# EAGLE design receiver (EAGLE 5.09)
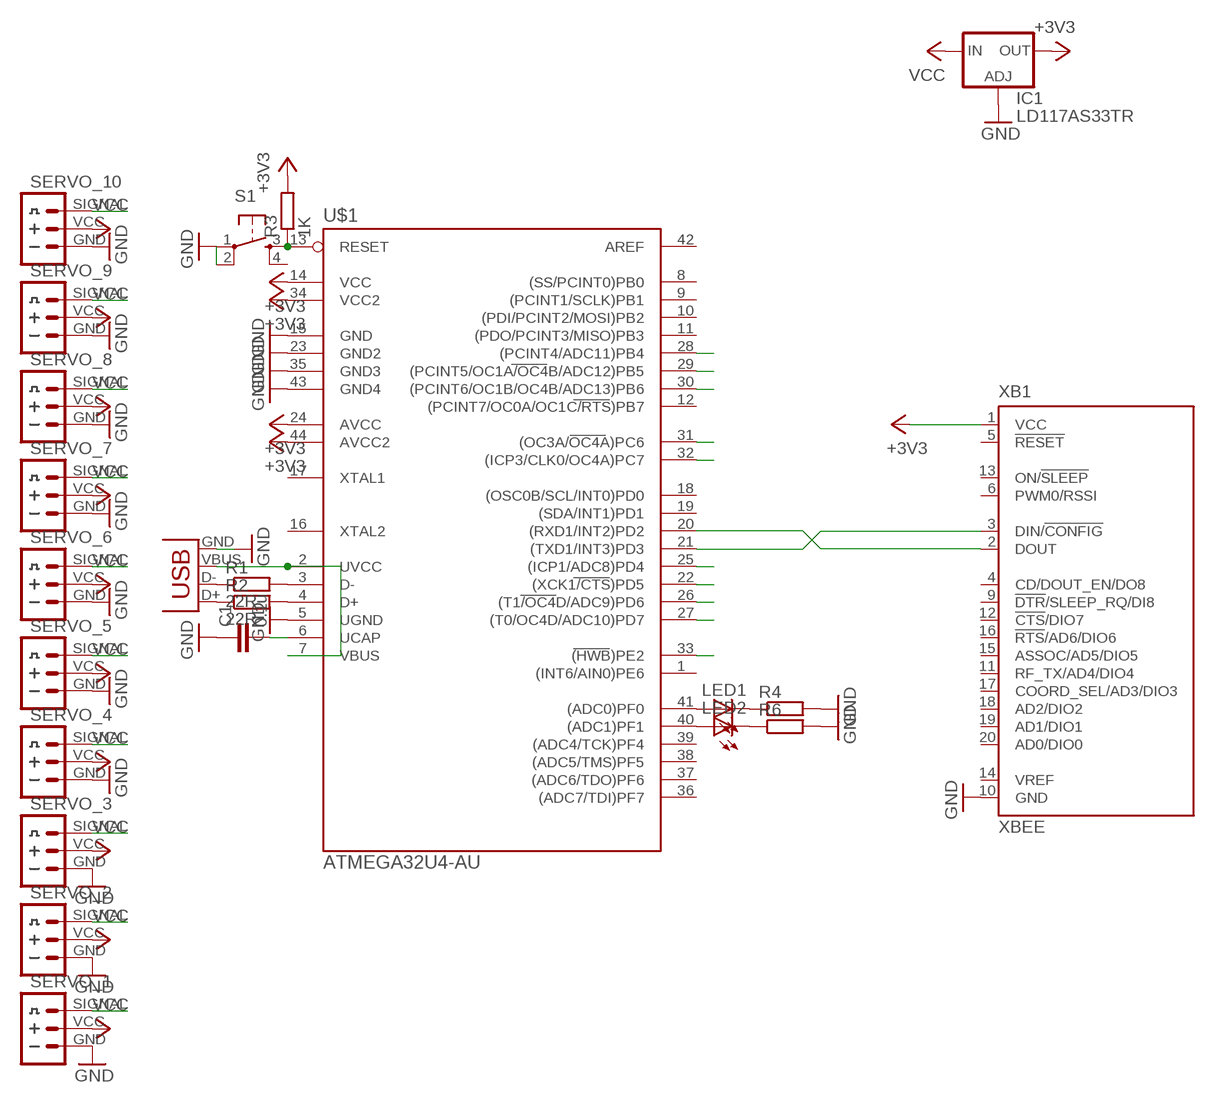
[diagram p0: schematic, sheet 1]

## Parts
C1  0.1u  C-EUC1206  [C1206]
IC1  LD117AS33TR  [SOT223]
LED1  LEDCHIPLED_1206  [CHIPLED_1206]
LED2  LEDCHIPLED_1206  [CHIPLED_1206]
R1  22R  R-EU_R1206  [R1206]
R2  22R  R-EU_R1206  [R1206]
R3  1K  R-EU_R1206  [R1206]
R4  R-EU_R1206  [R1206]
R6  R-EU_R1206  [R1206]
S1  TAC_SWITCHSMD  [TACTILE_SWITCH_SMD]
SERVO_1  SERVO  [SERVO]
SERVO_2  SERVO  [SERVO]
SERVO_3  SERVO  [SERVO]
SERVO_4  SERVO  [SERVO]
SERVO_5  SERVO  [SERVO]
SERVO_6  SERVO  [SERVO]
SERVO_7  SERVO  [SERVO]
SERVO_8  SERVO  [SERVO]
SERVO_9  SERVO  [SERVO]
SERVO_10  SERVO  [SERVO]
U$1  ATMEGA32U4-AU  [TQFP44]
X1  USBSMD  [USB-MINIB]
XB1  XBEE  [XBEE]

## Nets
+3V3: IC1.4(OUT) R3.2 U$1.14(VCC) U$1.24(AVCC) U$1.34(VCC2) U$1.44(AVCC2) XB1.1(VCC)
GND: C1.1 IC1.1(ADJ) R4.2 R6.2 S1.1 S1.2 SERVO_1.GND SERVO_2.GND SERVO_3.GND SERVO_4.GND SERVO_5.GND SERVO_6.GND SERVO_7.GND SERVO_8.GND SERVO_9.GND SERVO_10.GND U$1.5(UGND) U$1.15(GND) U$1.23(GND2) U$1.35(GND3) U$1.43(GND4) X1.GND XB1.10(GND)
N$1: R3.1 S1.3 U$1.13(RESET)
N$2: R1.1 X1.D-
N$3: R1.2 U$1.3(D-)
N$4: U$1.2(UVCC) U$1.7(VBUS) X1.VBUS
N$5: C1.2 U$1.6(UCAP)
N$6: R2.1 X1.D+
N$7: R2.2 U$1.4(D+)
N$8: U$1.21((TXD1/INT3)PD3) XB1.3(DIN/!CONFIG)
N$9: U$1.20((RXD1/INT2)PD2) XB1.2(DOUT)
N$10: LED1.A U$1.41((ADC0)PF0)
N$11: LED2.A U$1.40((ADC1)PF1)
N$12: LED1.C R4.1
N$14: LED2.C R6.1
SV1: SERVO_1.SIGNAL U$1.33((HWB)PE2)
SV2: SERVO_2.SIGNAL U$1.32((ICP3/CLK0/OC4A)PC7)
SV3: SERVO_3.SIGNAL U$1.31((OC3A/OC4A)PC6)
SV4: SERVO_4.SIGNAL U$1.30((PCINT6/OC1B/OC4B/ADC13)PB6)
SV5: SERVO_5.SIGNAL U$1.29((PCINT5/OC1A/OC4B/ADC12)PB5)
SV6: SERVO_6.SIGNAL U$1.28((PCINT4/ADC11)PB4)
SV7: SERVO_7.SIGNAL U$1.27((T0/OC4D/ADC10)PD7)
SV8: SERVO_8.SIGNAL U$1.26((T1/OC4D/ADC9)PD6)
SV9: SERVO_9.SIGNAL U$1.25((ICP1/ADC8)PD4)
SV10: SERVO_10.SIGNAL U$1.22((XCK1/CTS)PD5)
VCC: IC1.3(IN) SERVO_1.VCC SERVO_2.VCC SERVO_3.VCC SERVO_4.VCC SERVO_5.VCC SERVO_6.VCC SERVO_7.VCC SERVO_8.VCC SERVO_9.VCC SERVO_10.VCC
Unconnected: S1.4 U$1.1((INT6/AIN0)PE6) U$1.8((SS/PCINT0)PB0) U$1.9((PCINT1/SCLK)PB1) U$1.10((PDI/PCINT2/MOSI)PB2) U$1.11((PDO/PCINT3/MISO)PB3) U$1.12((PCINT7/OC0A/OC1C/RTS)PB7) U$1.16(XTAL2) U$1.17(XTAL1) U$1.18((OSC0B/SCL/INT0)PD0) U$1.19((SDA/INT1)PD1) U$1.36((ADC7/TDI)PF7) U$1.37((ADC6/TDO)PF6) U$1.38((ADC5/TMS)PF5) U$1.39((ADC4/TCK)PF4) U$1.42(AREF) XB1.4(CD/DOUT_EN/DO8) XB1.5(!RESET) XB1.6(PWM0/RSSI) XB1.9(!DTR!/SLEEP_RQ/DI8) XB1.11(RF_TX/AD4/DIO4) XB1.12(!CTS!/DIO7) XB1.13(ON/!SLEEP) XB1.14(VREF) XB1.15(ASSOC/AD5/DIO5) XB1.16(!RTS!/AD6/DIO6) XB1.17(COORD_SEL/AD3/DIO3) XB1.18(AD2/DIO2) XB1.19(AD1/DIO1) XB1.20(AD0/DIO0)

## Library data of the parts
C1 = rcl:C-EU: CAPACITOR, European symbol
IC1 = v-reg:LD117A?*: Low drop fixed and adjustable positive voltage regulators 1 A Source: http://www.st.com/stonline/products/literature/ds/7194/ld1117axx.pdf
LED1 LED2 = led:LED: LED OSRAM: - CHIPLED LG R971, LG N971, LY N971, LG Q971, LY Q971, LO R971, LY R971 LH N974, LH R974 LS Q976, LO Q976, LY Q976 LO Q996 - Hyper CHIPLED LW Q18S LB Q993, LB Q99A, LB R99A - SideLED LS A670, LO A670, LY A670, LG A670, LP A670 LB A673, LV A673, LT A673, LW A673 LH A674 LY A675 LS A676, LA A676, LO A676, LY A676, LW A676 LS A679, LY A679, LG A679 - Hyper Micro SIDELED® LS Y876, LA Y876, LO Y876, LY Y876 LT Y87S - SmartLED LW L88C, LW L88S LB L89C, LB L89S, LG L890 LS L89K, LO L89K, LY L89K LS L896, LA L896, LO L896, LY L896 - TOPLED LS T670, LO T670, LY T670, LG T670, LP T670 LSG T670, LSP T670, LSY T670, LOP T670, LYG T670 LG T671, LOG T671, LSG T671 LB T673, LV T673, LT T673, LW T673 LH T674 LS T676, LA T676, LO T676, LY T676, LB T676, LH T676, LSB T676, LW T676 LB T67C, LV T67C, LT T67C, LS T67K, LO T67K, LY T67K, LW E67C LS E67B, LA E67B, LO E67B, LY E67B, LB E67C, LV E67C, LT E67C LW T67C LS T679, LY T679, LG T679 LS T770, LO T770, LY T770, LG T770, LP T770 LB T773, LV T773, LT T773, LW T773 LH T774 LS E675, LA E675, LY E675, LS T675 LS T776, LA T776, LO T776, LY T776, LB T776 LHGB T686 LT T68C, LB T68C - Hyper Mini TOPLED® LB M676 - Mini TOPLED Santana® LG M470 LS M47K, LO M47K, LY M47K Source: http://www.osram.convergy.de LUXEON: - LUMILED® LXK2-PW12-R00, LXK2-PW12-S00, LXK2-PW14-U00, LXK2-PW14-V00 LXK2-PM12-R00, LXK2-PM12-S00, LXK2-PM14-U00 LXK2-PE12-Q00, LXK2-PE12-R00, LXK2-PE12-S00, LXK2-PE14-T00, LXK2-PE14-U00 LXK2-PB12-K00, LXK2-PB12-L00, LXK2-PB12-M00, LXK2-PB14-N00, LXK2-PB14-P00, LXK2-PB14-Q00 LXK2-PR12-L00, LXK2-PR12-M00, LXK2-PR14-Q00, LXK2-PR14-R00 LXK2-PD12-Q00, LXK2-PD12-R00, LXK2-PD12-S00 LXK2-PH12-R00, LXK2-PH12-S00 LXK2-PL12-P00, LXK2-PL12-Q00, LXK2-PL12-R00 Source: www.luxeon.com KINGBRIGHT: KA-3528ASYC Source: www.kingbright.com
R1 R2 = rcl:R-EU_: RESISTOR, European symbol
R3 R4 R6 = resistor:R-EU_: RESISTOR, European symbol
S1 = SparkFun:TAC_SWITCH: Momentary Switch Button commonly used for reset or general input. Spark Fun Electronics SKU : COM-00097
SERVO_1-SERVO_10 = parag0n:SERVO: SERVO CONNECTOR Standard pinout servo connector
U$1 = mega32U4:ATMEGA32U4-AU
X1 = SparkFun:USB: USB Connectors USB-B-PTH is fully proven SKU : PRT-00139 USB-miniB is fully proven SKU : PRT-00587 USB-A-PCB is untested. USB-A-H is throughly reviewed, but untested. Spark Fun Electronics SKU : PRT-00437 USB-B-SMT is throughly reviewed, but untested. Needs silkscreen touching up. USB-A-S has not been used/tested USB-MB-H has not been used/tested
XB1 = maxstream:XBEE: XBee (TM) /XBee-PRO(TM) OEM RF Modules Source: MaxStream, Inc. xbee_productmanual.pdf

## Board
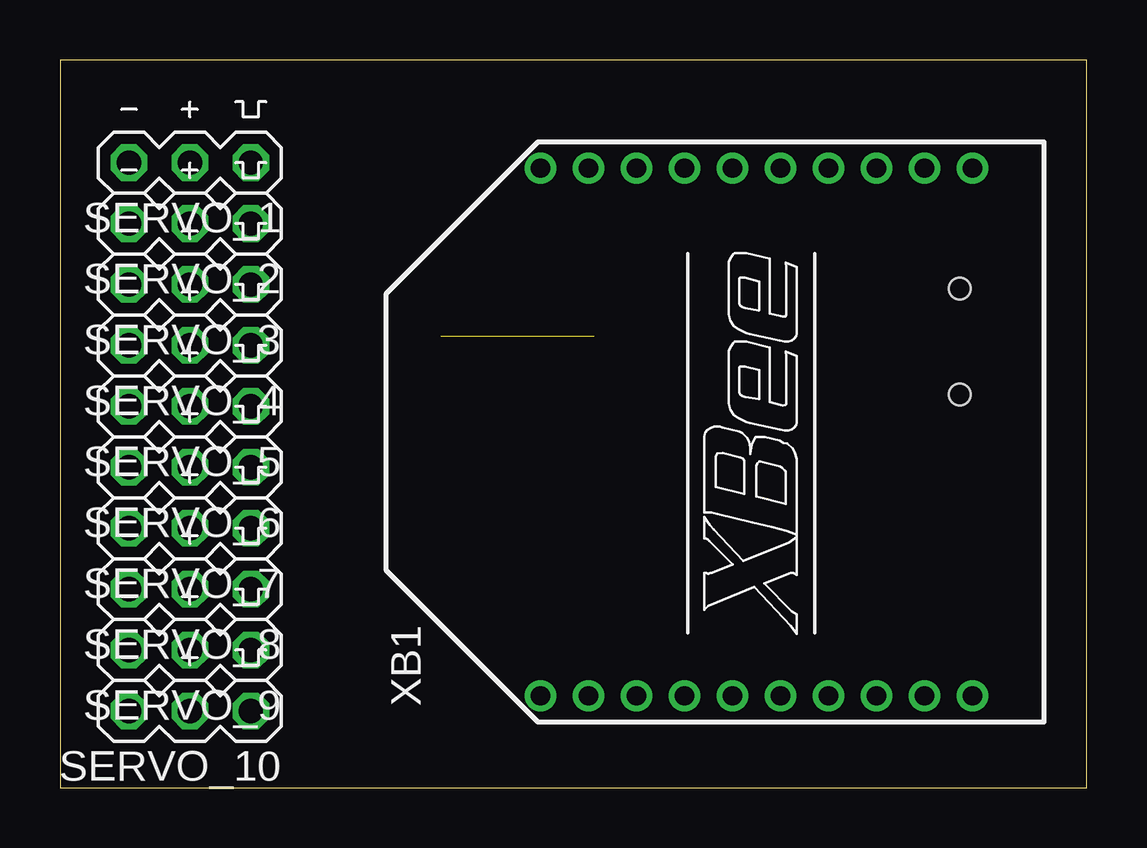
[diagram p1: board, top side]
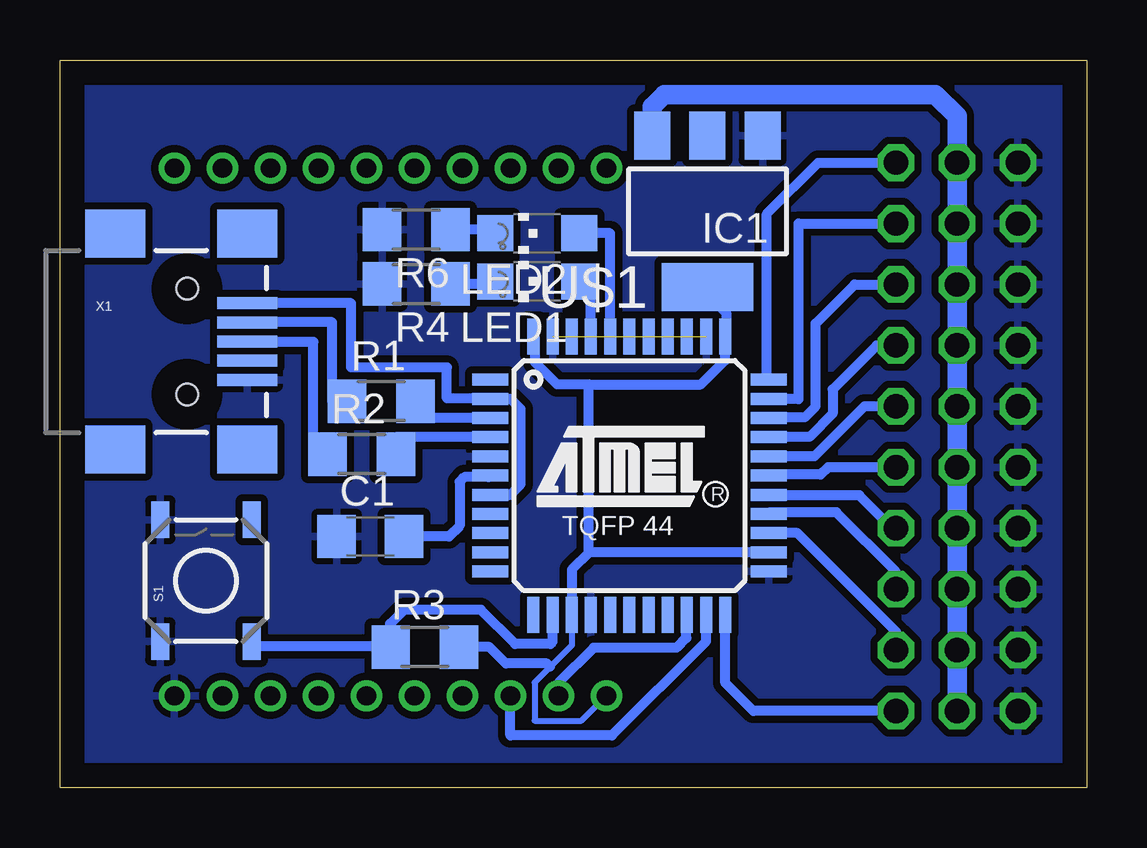
[diagram p2: board, bottom side, seen from below]

Size 42.79 x 30.34 mm. Coordinates in mm from the lower left corner, seen from the top.
Outline: 0,0 42.79,0 42.79,30.34 0,30.34 0,0
Copper layers (1*16): Top 0.035mm / dielectric 1.5mm / Bottom 0.035mm
Design rules "default": minimum track width 10mil, minimum drill 24mil, track to track 8mil, track to pad 8mil, pad to pad 8mil, via to via 8mil, smd to smd 8mil, copper to edge 40mil, drill to drill 8mil, minimum pad ring 10mil, minimum via ring 8mil, stop-mask expansion 4mil, vias tented up to drill 0mil, thermal gap 10mil

### Footprints (pad centres in the part's own frame; a part is rotated, then mirrored left to right if it is on the bottom)
C1206 = smd 1.6 x 1.8: 1 -1.4,0; 2 1.4,0
SOT223 = smd 1.5 x 2: 1 -2.3,-3.15; 2 0,-3.15; 3 2.3,-3.15 | smd 3.8 x 2: 4 0,3.15
CHIPLED_1206 = smd 1.5 x 1.5: A 0,-1.75; C 0,1.75
R1206 = smd 1.6 x 1.803: 1 -1.422,0; 2 1.422,0
TACTILE_SWITCH_SMD = smd 1.524 x 0.762: 1 -2.54,1.905; 2 2.54,1.905; 3 -2.54,-1.905; 4 2.54,-1.905
SERVO = drill 1.016 octagon: GND 2.54,0; SIGNAL -2.54,0; VCC 0,0
TQFP44 = smd 1.5 x 0.5: 1 -5.8,4; 2 -5.8,3.2; 3 -5.8,2.4; 4 -5.8,1.6; 5 -5.8,0.8; 6 -5.8,0; 7 -5.8,-0.8; 8 -5.8,-1.6; 9 -5.8,-2.4; 10 -5.8,-3.2; 11 -5.8,-4; 23 5.8,-4; 24 5.8,-3.2; 25 5.8,-2.4; 26 5.8,-1.6; 27 5.8,-0.8; 28 5.8,0; 29 5.8,0.8; 30 5.8,1.6; 31 5.8,2.4; 32 5.8,3.2; 33 5.8,4 | smd 0.5 x 1.5: 12 -4,-5.8; 13 -3.2,-5.8; 14 -2.4,-5.8; 15 -1.6,-5.8; 16 -0.8,-5.8; 17 0,-5.8; 18 0.8,-5.8; 19 1.6,-5.8; 20 2.4,-5.8; 21 3.2,-5.8; 22 4,-5.8; 34 4,5.8; 35 3.2,5.8; 36 2.4,5.8; 37 1.6,5.8; 38 0.8,5.8; 39 0,5.8; 40 -0.8,5.8; 41 -1.6,5.8; 42 -2.4,5.8; 43 -3.2,5.8; 44 -4,5.8
USB-MINIB = smd 2.5 x 0.5: D+ 2.5,0; D- 2.5,0.8; GND 2.5,-1.6; ID 2.5,-0.8; VBUS 2.5,1.6 | smd 2.5 x 2: GND@1 -3,-4.5; GND@2 -3,4.5; GND@3 2.5,4.5; GND@4 2.5,-4.5 | hole 0.9: 0,2.2; 0,-2.2
XBEE = drill 0.8 pad 1.27 round: 1 -11,9; 2 -11,7; 3 -11,5; 4 -11,3; 5 -11,1; 6 -11,-1; 7 -11,-3; 8 -11,-5; 9 -11,-7; 10 -11,-9; 11 11,-9; 12 11,-7; 13 11,-5; 14 11,-3; 15 11,-1; 16 11,1; 17 11,3; 18 11,5; 19 11,7; 20 11,9

### Placement (x,y rotation side)
C1  29.86,10.48 0 bottom
IC1  15.81,24.03 180 bottom
LED1  22.91,21.11 90 bottom
LED2  22.91,23.11 90 bottom
R1  29.4,16.12 0 bottom
R2  30.21,13.91 0 bottom
R3  27.58,5.87 0 bottom
R4  27.94,21.01 180 bottom
R6  27.94,23.27 180 bottom
S1  36.7,8.64 90 bottom
SERVO_1  5.41,26.06 180 top
SERVO_2  5.41,23.52 180 top
SERVO_3  5.41,20.98 180 top
SERVO_4  5.41,18.44 180 top
SERVO_5  5.41,15.9 180 top
SERVO_6  5.41,13.36 180 top
SERVO_7  5.41,10.82 180 top
SERVO_8  5.41,8.28 180 top
SERVO_9  5.41,5.74 180 top
SERVO_10  5.41,3.2 180 top
U$1  19.06,13.02 0 bottom
X1  37.49,18.61 0 bottom
XB1  29.02,14.83 90 top

### Tracks (layer width: path | path; a pad name or v marks a point on that pad's centre or on a via)
+3V3
  Bottom 0.254: U$1.14 21.46,5.94 22.36,5.04 23.01,4.39 23.01,2.79 21.06,2.79 XB1.1
  Bottom 0.406: U$1.44 22.99,18.74 22.99,17.73 22.07,16.82 20.75,16.82 | U$1.14 21.46,9.09 20.74,9.82 | 20.75,16.82 16.08,16.82 15.06,17.83 U$1.34 | U$1.34 | U$1.24 20.74,9.82 | 20.74,9.82 20.75,9.83 20.75,16.82 | IC1.4 15.81,20.56 15.01,19.76 15.01,18.87 U$1.34 | R3.2 24.89,5.87 24.21,5.18 22.5,5.18 22.36,5.04
GND  (1 unrouted)
  Bottom 0.406: U$1.15
  pour Bottom (isolate 0.305): -0.89,30.43 42.09,30.43 41.78,-0.86 -0.79,-0.56
N$1
  Bottom 0.406: U$1.13 22.26,6.08 22.35,5.99 23.83,5.99 25.25,7.42 28.45,7.42 29.03,6.83 29.03,5.89 | 29.03,5.89 R3.1 | 29.03,5.89 34.8,5.89 S1.3
N$2
  Bottom 0.406: R1.1 31.45,16.12 31.45,19.41 X1.D- | X1.D-
N$3
  Bottom 0.406: U$1.3 27.66,15.42 R1.2
N$4
  Bottom 0.406: U$1.7 24.03,12.22 23.6,12.65 23.6,15.8 24,16.21 24.31,16.21 | 24.31,16.21 24.85,16.21 U$1.2 | X1.VBUS 30.66,20.21 30.66,17.53 26.67,17.53 26.67,16.23 24.31,16.23 24.31,16.21
N$5
  Bottom 0.406: U$1.6 24.93,12.95 25.93,12.95 26.14,12.75 26.14,10.92 26.58,10.48 C1.2 28.41,10.48
N$6
  Bottom 0.406: R2.1 32.23,13.91 32.23,18.59 34.99,18.59 X1.D+
N$7
  Bottom 0.406: U$1.4 28.79,14.62 R2.2
N$8
  Bottom 0.406: U$1.21 15.86,6.11 19.79,2.18 24.02,2.18 XB1.3
N$9
  Bottom 0.406: XB1.2 22.02,4.37 20.55,5.84 17.09,5.84 16.69,6.25 16.69,7.19 U$1.20
N$10
  Bottom 0.406: U$1.41 20.66,21.11 LED1.A
N$11
  Bottom 0.406: U$1.40 19.86,23.11 LED2.A
N$12
  Bottom 0.406: LED1.C 24.66,21.01 R4.1
N$14
  Bottom 0.406: LED2.C 24.66,23.27 R6.1
SV1
  Bottom 0.406: SERVO_1.SIGNAL 11.2,26.06 13.34,23.93 13.34,17.09 U$1.33
SV2
  Bottom 0.406: SERVO_2.SIGNAL 12.01,23.52 12.01,16.21 13.28,16.21 U$1.32
SV3
  Bottom 0.406: SERVO_3.SIGNAL 9.68,20.98 11.3,19.36 11.3,15.9 11.76,15.44 13.24,15.44 U$1.31
SV4
  Bottom 0.406: SERVO_4.SIGNAL 8.76,18.44 10.59,16.61 10.59,15.6 11.56,14.63 U$1.30
SV5
  Bottom 0.406: SERVO_5.SIGNAL 9.27,15.9 11.35,13.82 U$1.29
SV6
  Bottom 0.406: SERVO_6.SIGNAL 10.8,13.36 11.1,13.06 13.22,13.06 U$1.28
SV7
  Bottom 0.406: SERVO_7.SIGNAL 8.1,10.82 9.47,12.19 13.24,12.19 U$1.27
SV8
  Bottom 0.406: SERVO_8.SIGNAL 7.95,8.99 10.44,11.48 13.2,11.48 U$1.26
SV9
  Bottom 0.406: SERVO_9.SIGNAL 7.95,6.5 12.07,10.62 U$1.25
SV10
  Bottom 0.406: SERVO_10.SIGNAL 13.89,3.2 15.06,4.37 U$1.22
VCC
  Bottom 0.813: SERVO_1.VCC SERVO_2.VCC SERVO_3.VCC SERVO_4.VCC SERVO_5.VCC SERVO_6.VCC SERVO_7.VCC SERVO_8.VCC SERVO_9.VCC SERVO_10.VCC | SERVO_1.VCC | IC1.3 18.11,28.4 17.6,28.91 6.32,28.91 5.41,27.99 SERVO_1.VCC